# EAGLE schematic DAQ Terminal (EAGLE 8.6.0)
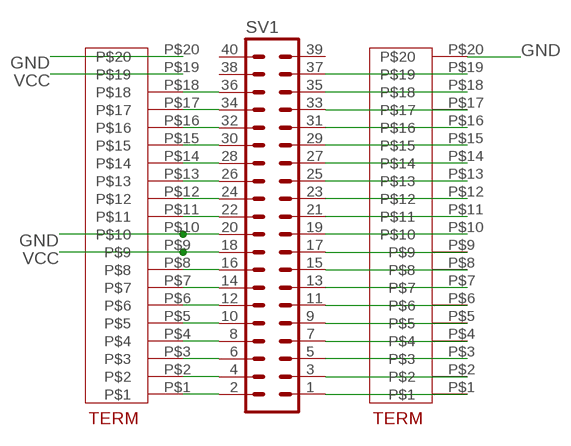
[diagram p0: schematic, sheet 1]

## Parts
SV1  MA20-2  [MA20-2]
U$1  20TERM  [20TERM]
U$2  20TERM  [20TERM]

## Nets
GND: SV1.20 U$1.P$20 U$2.P$10 U$2.P$20
N$1: SV1.2 U$2.P$1
N$2: SV1.4 U$2.P$2
N$3: SV1.6 U$2.P$3
N$4: SV1.8 U$2.P$4
N$5: SV1.10 U$2.P$5
N$6: SV1.12 U$2.P$6
N$7: SV1.14 U$2.P$7
N$8: SV1.16 U$2.P$8
N$11: SV1.22 U$2.P$11
N$12: SV1.24 U$2.P$12
N$13: SV1.26 U$2.P$13
N$14: SV1.28 U$2.P$14
N$15: SV1.30 U$2.P$15
N$16: SV1.32 U$2.P$16
N$17: SV1.34 U$2.P$17
N$18: SV1.36 U$2.P$18
N$21: SV1.1 U$1.P$1
N$22: SV1.3 U$1.P$2
N$23: SV1.5 U$1.P$3
N$24: SV1.7 U$1.P$4
N$25: SV1.9 U$1.P$5
N$26: SV1.11 U$1.P$6
N$27: SV1.13 U$1.P$7
N$28: SV1.15 U$1.P$8
N$29: SV1.17 U$1.P$9
N$30: SV1.19 U$1.P$10
N$31: SV1.21 U$1.P$11
N$32: SV1.23 U$1.P$12
N$33: SV1.25 U$1.P$13
N$34: SV1.27 U$1.P$14
N$35: SV1.29 U$1.P$15
N$36: SV1.31 U$1.P$16
N$37: SV1.33 U$1.P$17
N$38: SV1.35 U$1.P$18
N$39: SV1.37 U$1.P$19
VCC: SV1.18 U$2.P$9 U$2.P$19
Unconnected: SV1.38 SV1.39 SV1.40

## Library data of the parts
SV1 = con-lstb:MA20-2: PIN HEADER; OC_FARNELL: unknown; OC_NEWARK: unknown
U$1 U$2 = 20TERM:20TERM